# EAGLE schematic AFE (EAGLE 8.3.1)

## Sheet 1 of 2
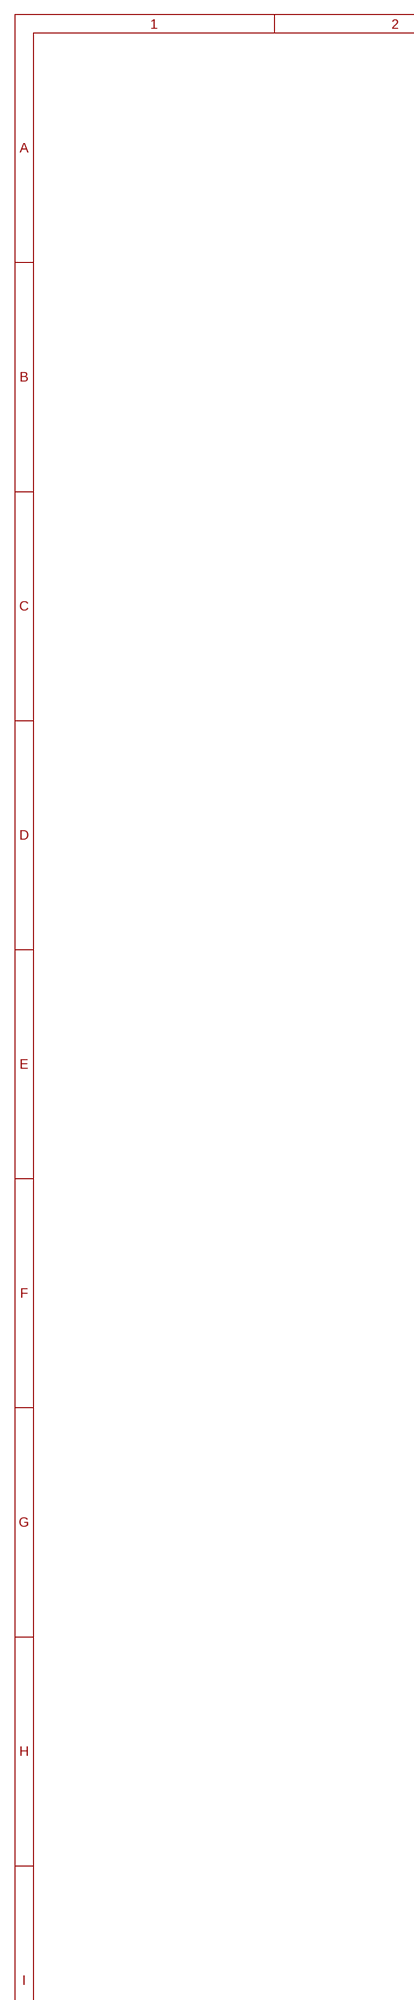
[diagram p0: schematic, sheet 1, part 1 of 2]
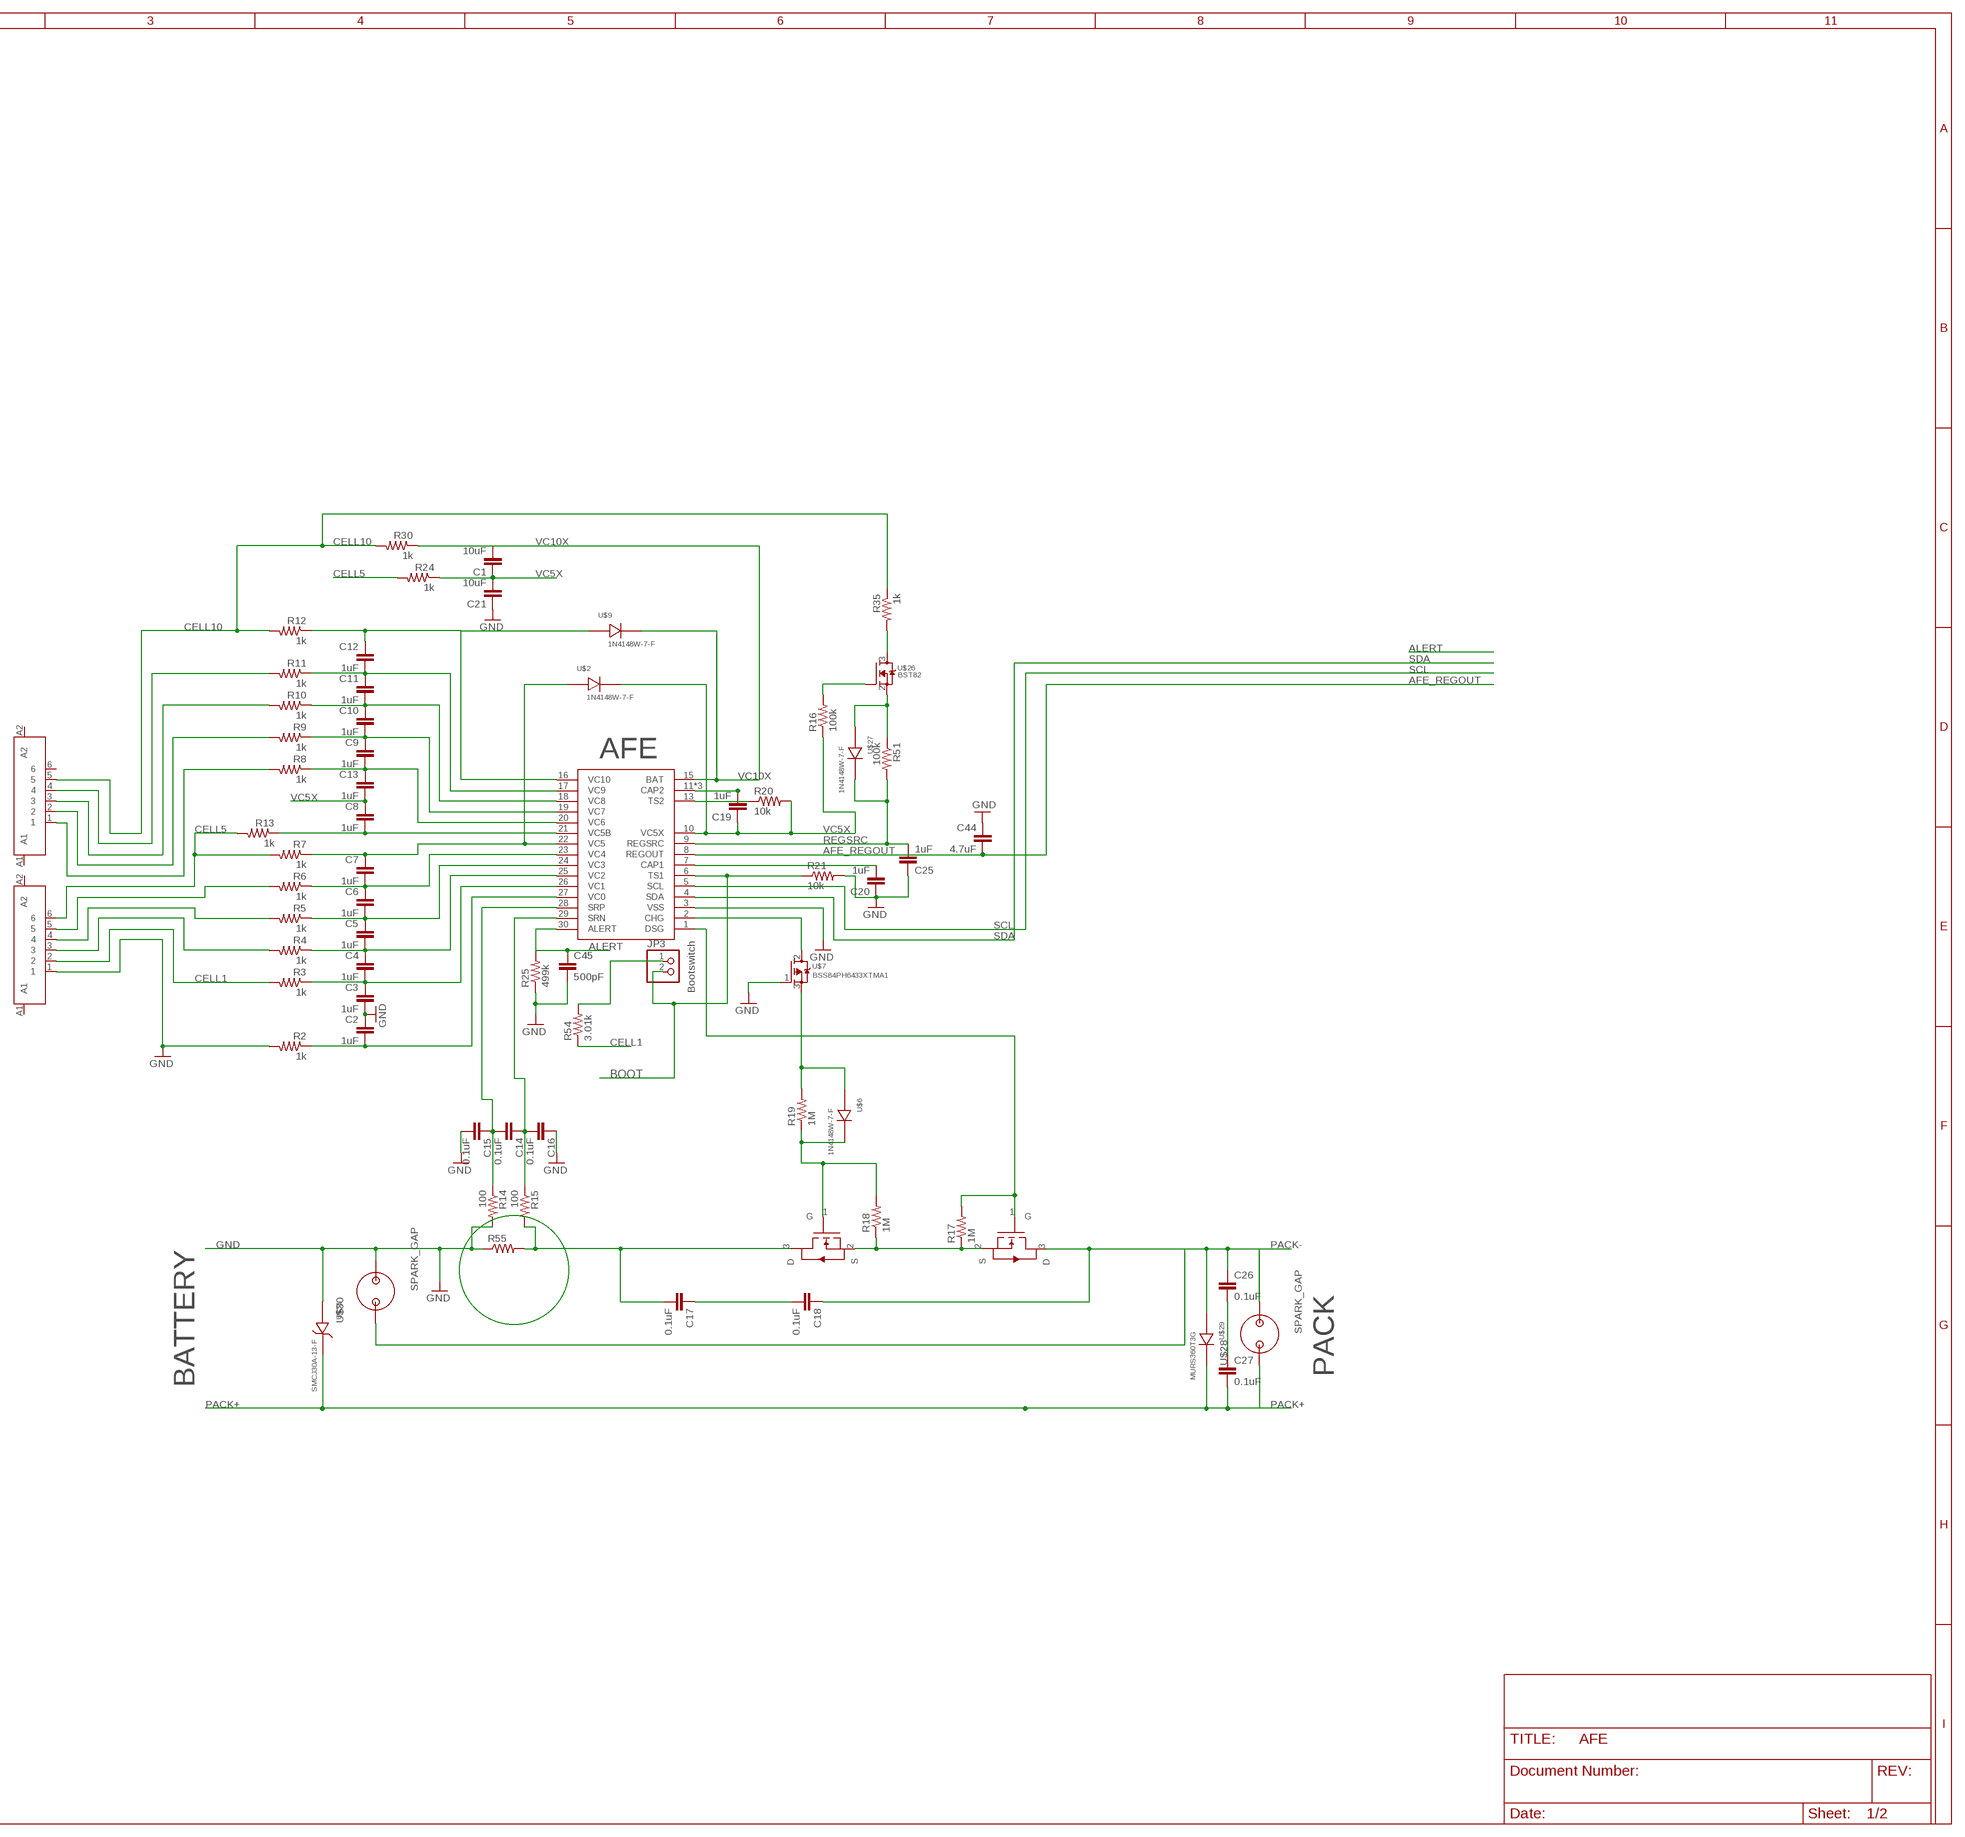
[diagram p1: schematic, sheet 1, part 2 of 2]

### Parts
C1  10uF  C-EUC1210  [C1210]
C2  1uF  C-EUC0805  [C0805]
C3  1uF  C-EUC0805  [C0805]
C4  1uF  C-EUC0805  [C0805]
C5  1uF  C-EUC0805  [C0805]
C6  1uF  C-EUC0805  [C0805]
C7  1uF  C-EUC0805  [C0805]
C8  1uF  C-EUC0805  [C0805]
C9  1uF  C-EUC0805  [C0805]
C10  1uF  C-EUC0805  [C0805]
C11  1uF  C-EUC0805  [C0805]
C12  1uF  C-EUC0805  [C0805]
C13  1uF  C-EUC0805  [C0805]
C14  0.1uF  C-EUC0805  [C0805]
C15  0.1uF  C-EUC0805  [C0805]
C16  0.1uF  C-EUC0805  [C0805]
C17  0.1uF  C-EUC0805  [C0805]
C18  0.1uF  C-EUC0805  [C0805]
C19  1uF  C-EUC0805  [C0805]
C20  1uF  C-EUC0805  [C0805]
C21  10uF  C-EUC1210  [C1210]
C25  1uF  C-EUC0805  [C0805]
C26  0.1uF  C-EUC0805  [C0805]
C27  0.1uF  C-EUC0805  [C0805]
C44  4.7uF  C-EUC0805  [C0805]
C45  500pF  C-EUC0603  [C0603]
JP3  PINHD-1X2  [1X02]
R2  1k  R-US_R1206  [R1206]
R3  1k  R-US_R1206  [R1206]
R4  1k  R-US_R1206  [R1206]
R5  1k  R-US_R1206  [R1206]
R6  1k  R-US_R1206  [R1206]
R7  1k  R-US_R1206  [R1206]
R8  1k  R-US_R1206  [R1206]
R9  1k  R-US_R1206  [R1206]
R10  1k  R-US_R1206  [R1206]
R11  1k  R-US_R1206  [R1206]
R12  1k  R-US_R1206  [R1206]
R13  1k  R-US_R1206  [R1206]
R14  100  R-US_R0805  [R0805]
R15  100  R-US_R0805  [R0805]
R16  100k  R-US_R0805  [R0805]
R17  1M  R-US_R1206  [R1206]
R18  1M  R-US_R1206  [R1206]
R19  1M  R-US_R1206  [R1206]
R20  10k  R-US_R0805  [R0805]
R21  10k  R-US_R0805  [R0805]
R24  1k  R-US_R1206  [R1206]
R25  499k  R-US_R0603  [R0603]
R30  1k  R-US_R1206  [R1206]
R35  1k  R-US_R1206  [R1206]
R51  100k  R-US_R0805  [R0805]
R54  3.01k  R-US_R1206  [R1206]
R55  R-US_R2512  [R2512]
U$1  BQ76930  [SOIC-30]
U$2  1N4148W-7-F  [SOD-123]
U$4  AOB290L  [TO-263]
U$5  AOB290L  [TO-263]
U$6  1N4148W-7-F  [SOD-123]
U$7  BSS84PH6433XTMA1  [SOT23-3]
U$9  1N4148W-7-F  [SOD-123]
U$24  JST_6PIN  [JST_6PIN]
U$26  BST82  [SOT23-3]
U$27  1N4148W-7-F  [SOD-123]
U$28  SPARK_GAP  [SPARK_GAP]
U$29  MURS360T3G  [SMC(DO-214AB)]
U$30  SPARK_GAP  [SPARK_GAP]
U$31  SMCJ30A-13-F  [SMB(DO-214AA)]
U$33  JST_6PIN  [JST_6PIN]

### Nets
AFE_REGOUT: C44.2 U$1.8(REGOUT) ; also sheet 2
ALERT: C45.1 R25.2 U$1.30(ALERT) ; also sheet 2
BOOT: JP3.2 R21.1 U$1.6(TS1)
CELL1: R3.2 R54.1 U$33.2 ; also sheet 2
CELL5: R7.2 R13.2 R24.2 U$33.6
CELL10: R12.2 R30.2 R35.1 U$24.5
CHARGE-: R17.1 R18.1 U$4.2(S) U$5.2(S)
GND: C2.1 C3.2 C15.2 C16.1 C20.1 C21.1 C25.1 C44.1 C45.2 R2.2 R14.2 R21.2 R25.1 R55.1 U$1.3(VSS) U$7.1(G) U$30.P$2 U$31.P$1 U$33.1 ; also sheet 2
N$1: C3.1 C4.2 R3.1 U$1.26(VC1)
N$2: C4.1 C5.2 R4.1 U$1.25(VC2)
N$3: C5.1 C6.2 R5.1 U$1.24(VC3)
N$4: C6.1 C7.2 R6.1 U$1.23(VC4)
N$5: C7.1 R7.1 U$1.22(VC5) U$2.P$1
N$6: C8.2 R13.1 U$1.21(VC5B)
N$7: C9.1 C10.2 R9.1 U$1.19(VC7)
N$8: C10.1 C11.2 R10.1 U$1.18(VC8)
N$9: C11.1 C12.2 R11.1 U$1.17(VC9)
N$10: C12.1 R12.1 U$1.16(VC10) U$9.P$1
N$11: R5.2 U$33.4
N$12: C2.2 R2.1 U$1.27(VC0)
N$14: C26.2 C27.1
N$15: R4.2 U$33.3
N$16: R6.2 U$33.5
N$18: R8.2 U$24.1
N$19: R9.2 U$24.2
N$20: R10.2 U$24.3
N$21: R11.2 U$24.4
N$23: C9.2 C13.1 R8.1 U$1.20(VC6)
N$24: R16.2 U$26.1(G)
N$25: C20.2 U$1.7(CAP1)
N$26: C14.1 C16.2 R15.1 U$1.29(SRN)
N$27: JP3.1 R54.2
N$28: C14.2 C15.1 R14.1 U$1.28(SRP)
N$32: R18.2 R19.1 U$5.1(G) U$6.P$2
N$33: R19.2 U$6.P$1 U$7.3(D)
N$34: U$1.2(CHG) U$7.2(S)
N$35: C17.1 C18.2
N$37: C19.2 U$1.11(CAP2) U$1.12(CAP2) U$1.14(CAP2)
N$38: R20.1 U$1.13(TS2)
N$39: C17.2 R15.2 R55.2 U$5.3(D)
N$42: R17.2 U$1.1(DSG) U$4.1(G)
N$70: R51.1 U$26.2(S) U$27.P$1
N$72: R35.2 U$26.3(D)
PACK+: C27.2 U$28.P$1 U$29.2 U$31.P$2
PACK-: C18.1 C26.1 U$4.3(D) U$28.P$2 U$29.1 U$30.P$1
REGSRC: C25.2 R51.2 U$1.9(REGSRC) U$27.P$2
SCL: U$1.5(SCL) ; also sheet 2
SDA: U$1.4(SDA) ; also sheet 2
VC5X: C1.1 C8.1 C13.2 C19.1 C21.2 R16.1 R20.2 R24.1 U$1.10(VC5X) U$2.P$2
VC10X: C1.2 R30.1 U$1.15(BAT) U$9.P$2
Unconnected: U$24.6 U$24.A1 U$24.A2 U$33.A1 U$33.A2

### Notes on the sheet
- AFE
- Bootswitch
- PACK
- BATTERY

## Sheet 2 of 2
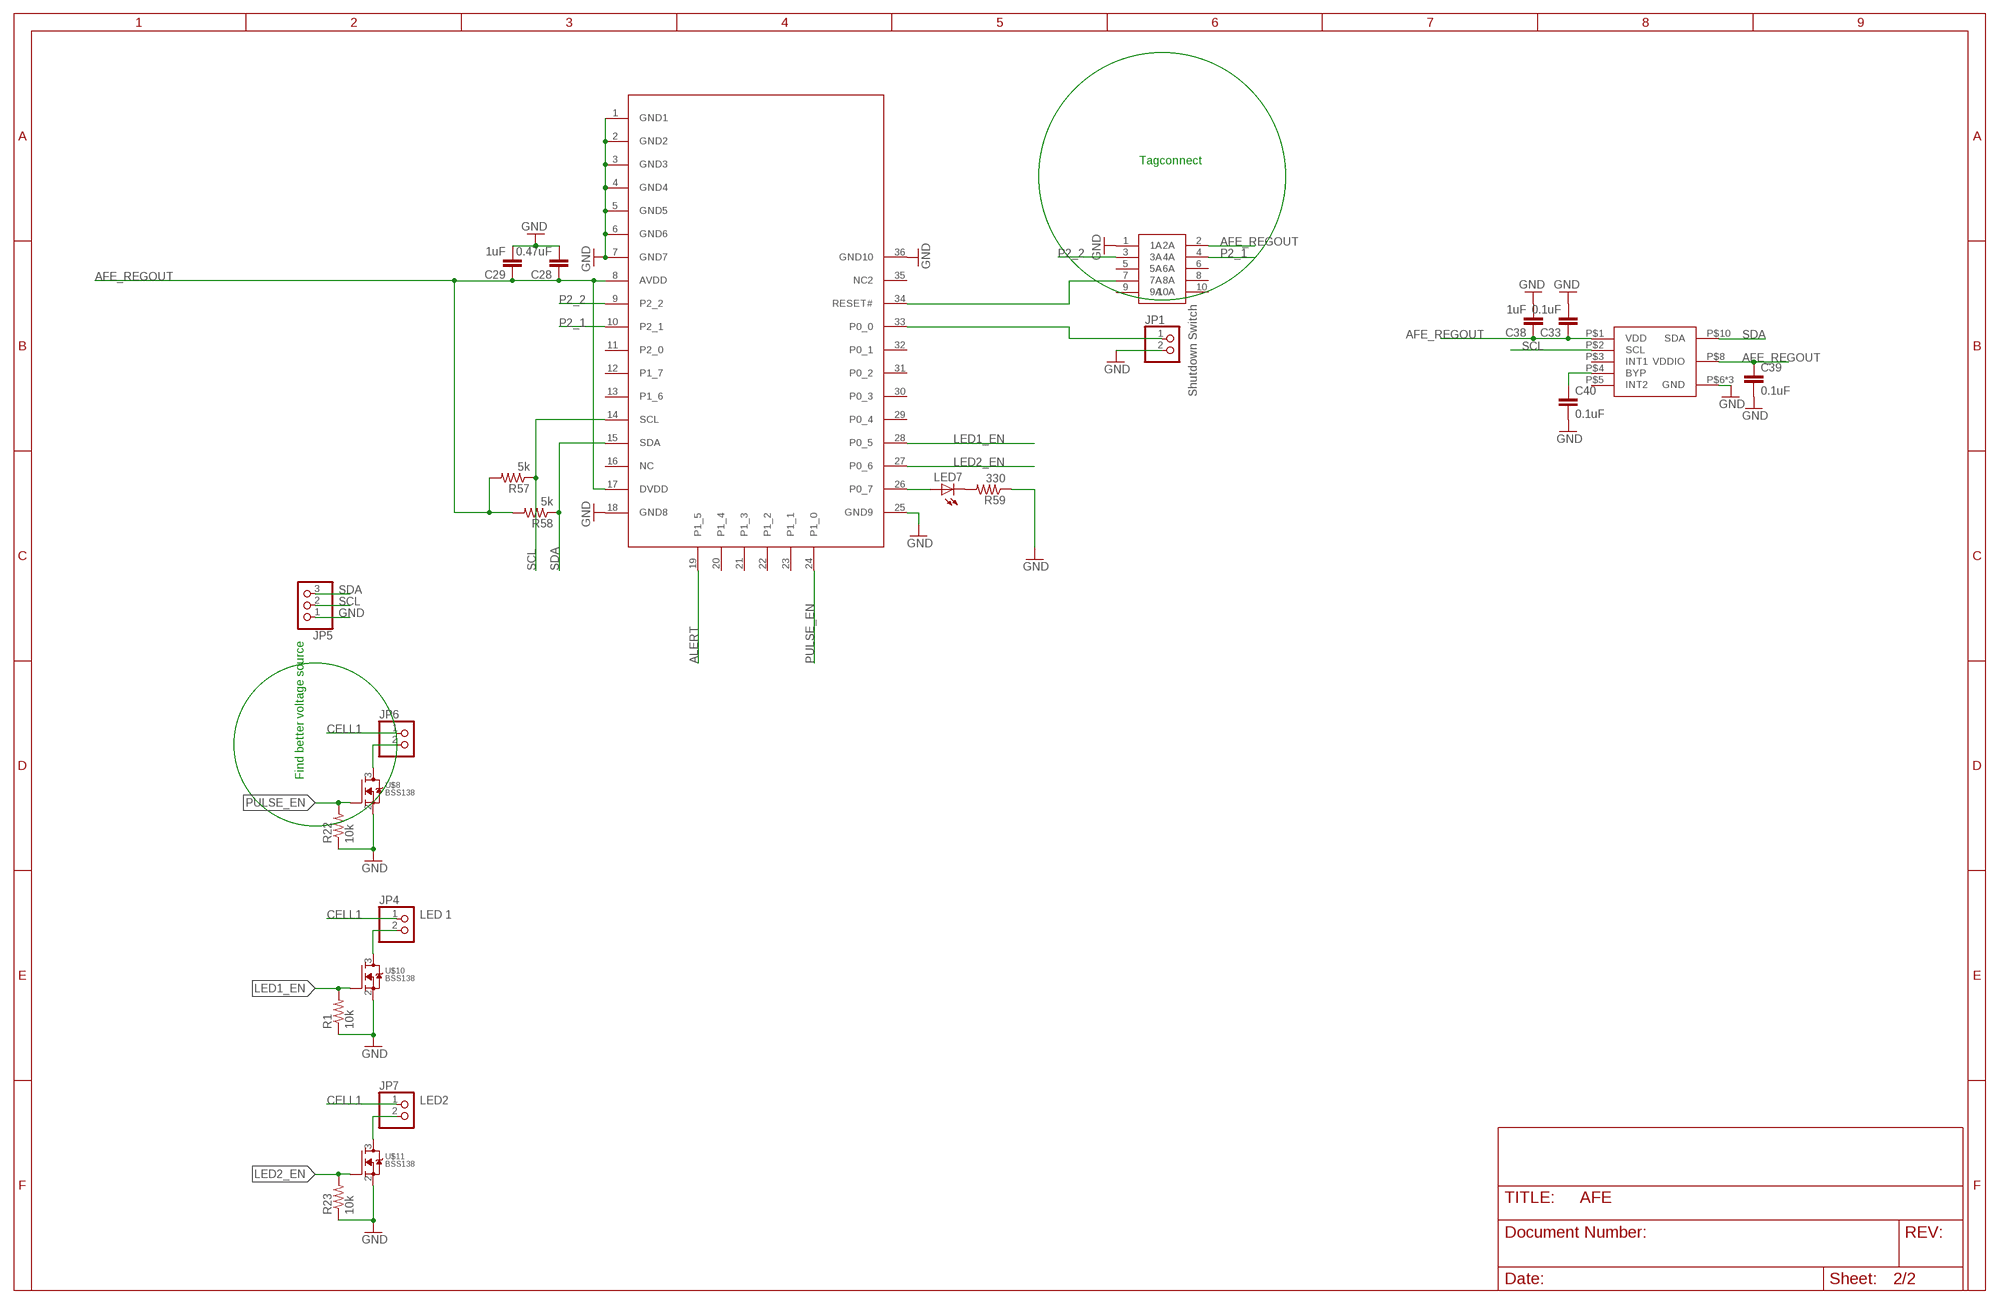
[diagram p2: schematic, sheet 2]

### Parts
C28  0.47uF  C-EUC0402  [C0402]
C29  1uF  C-EUC0402  [C0402]
C33  0.1uF  C-EUC0402  [C0402]
C38  1uF  C-EUC0402  [C0402]
C39  0.1uF  C-EUC0402  [C0402]
C40  0.1uF  C-EUC0402  [C0402]
JP1  PINHD-1X2  [1X02]
JP4  PINHD-1X2  [1X02]
JP5  PINHD-1X3  [1X03]
JP6  PINHD-1X2  [1X02]
JP7  PINHD-1X2  [1X02]
LED7  LEDCHIP-LED0603  [CHIP-LED0603]
R1  10k  R-US_R0402  [R0402]
R22  10k  R-US_R0402  [R0402]
R23  10k  R-US_R0402  [R0402]
R57  5k  R-US_R0402  [R0402]
R58  5k  R-US_R0402  [R0402]
R59  330  R-US_R0402  [R0402]
U$8  BSS138  [SOT23-3]
U$10  BSS138  [SOT23-3]
U$11  BSS138  [SOT23-3]
U$20  BLE113  [BLUEGIGA]
U$22  RIBBON_10POS_MALE  [RIBBON_10POS_MALE]
U$32  MMA8653FC  [10-DFN2X2]

### Nets
AFE_REGOUT: C28.1 C29.1 C33.1 C38.1 C39.1 R57.2 R58.2 U$20.8(AVDD) U$20.17(DVDD) U$22.2(2A) U$32.P$1(VDD) U$32.P$8(VDDIO) ; also sheet 1
ALERT: U$20.19(P1_5) ; also sheet 1
CD: JP1.1 U$20.33(P0_0)
CELL1: JP4.1 JP6.1 JP7.1 ; also sheet 1
GND: C28.2 C29.2 C33.2 C38.2 C39.2 C40.2 JP1.2 JP5.1 R1.1 R22.1 R23.1 R59.1 U$8.2(S) U$10.2(S) U$11.2(S) U$20.1(GND1) U$20.2(GND2) U$20.3(GND3) U$20.4(GND4) U$20.5(GND5) U$20.6(GND6) U$20.7(GND7) U$20.18(GND8) U$20.25(GND9) U$20.36(GND10) U$22.1(1A) U$32.P$6(GND) U$32.P$7(GND) U$32.P$9(GND) ; also sheet 1
LED1_EN: R1.2 U$10.1(G) U$20.28(P0_5)
LED2_EN: R23.2 U$11.1(G) U$20.27(P0_6)
N$29: JP4.2 U$10.3(D)
N$31: JP6.2 U$8.3(D)
N$36: LED7.A U$20.26(P0_7)
N$41: JP7.2 U$11.3(D)
N$76: LED7.C R59.2
N$77: U$20.34(RESET#) U$22.7(7A)
N$84: C40.1 U$32.P$4(BYP)
P2_1: U$20.10(P2_1) U$22.4(4A)
P2_2: U$20.9(P2_2) U$22.3(3A)
PULSE_EN: R22.2 U$8.1(G) U$20.24(P1_0)
SCL: JP5.2 R57.1 U$20.14(SCL) U$32.P$2(SCL) ; also sheet 1
SDA: JP5.3 R58.1 U$20.15(SDA) U$32.P$10(SDA) ; also sheet 1
Unconnected: U$20.11(P2_0) U$20.12(P1_7) U$20.13(P1_6) U$20.16(NC) U$20.20(P1_4) U$20.21(P1_3) U$20.22(P1_2) U$20.23(P1_1) U$20.29(P0_4) U$20.30(P0_3) U$20.31(P0_2) U$20.32(P0_1) U$20.35(NC2) U$22.5(5A) U$22.6(6A) U$22.8(8A) U$22.9(9A) U$22.10(10A) U$32.P$3(INT1) U$32.P$5(INT2)

### Notes on the sheet
- Tagconnect
- Shutdown Switch
- Find better voltage source
- LED 1
- LED2

## Library data of the parts
C1-C21 C25-C29 C33 C38-C40 C44 C45 = rcl:C-EU: CAPACITOR, European symbol
JP1 JP3 JP4 JP6 JP7 = pinhead:PINHD-1X2: PIN HEADER
JP5 = pinhead:PINHD-1X3: PIN HEADER
LED7 = adafruit:LED: LED OSRAM: - CHIPLED LG R971, LG N971, LY N971, LG Q971, LY Q971, LO R971, LY R971 LH N974, LH R974 LS Q976, LO Q976, LY Q976 LO Q996 - Hyper CHIPLED LW Q18S LB Q993, LB Q99A, LB R99A - SideLED LS A670, LO A670, LY A670, LG A670, LP A670 LB A673, LV A673, LT A673, LW A673 LH A674 LY A675 LS A676, LA A676, LO A676, LY A676, LW A676 LS A679, LY A679, LG A679 - Hyper Micro SIDELED® LS Y876, LA Y876, LO Y876, LY Y876 LT Y87S - SmartLED LW L88C, LW L88S LB L89C, LB L89S, LG L890 LS L89K, LO L89K, LY L89K LS L896, LA L896, LO L896, LY L896 - TOPLED LS T670, LO T670, LY T670, LG T670, LP T670 LSG T670, LSP T670, LSY T670, LOP T670, LYG T670 LG T671, LOG T671, LSG T671 LB T673, LV T673, LT T673, LW T673 LH T674 LS T676, LA T676, LO T676, LY T676, LB T676, LH T676, LSB T676, LW T676 LB T67C, LV T67C, LT T67C, LS T67K, LO T67K, LY T67K, LW E67C LS E67B, LA E67B, LO E67B, LY E67B, LB E67C, LV E67C, LT E67C LW T67C LS T679, LY T679, LG T679 LS T770, LO T770, LY T770, LG T770, LP T770 LB T773, LV T773, LT T773, LW T773 LH T774 LS E675, LA E675, LY E675, LS T675 LS T776, LA T776, LO T776, LY T776, LB T776 LHGB T686 LT T68C, LB T68C - Hyper Mini TOPLED® LB M676 - Mini TOPLED Santana® LG M470 LS M47K, LO M47K, LY M47K Source: http://www.osram.convergy.de/
R1-R25 R30 R35 R51 R54 R55 R57-R59 = rcl:R-US_: RESISTOR, American symbol
U$1 = Charles:BQ76930
U$2 U$6 U$9 U$27 = Charles:1N4148W-7-F: DIODE GENERAL PURPOSE 100V 300MA
U$4 U$5 = Charles:AOB290L
U$7 = Charles:BSS84PH6433XTMA1: MOSFET P-Channel 60V 170MA SOT-23
U$8 U$10 U$11 = Charles:BSS138: MOSFET N-CH 50V 220MA
U$20 = James_Updated:BLE113
U$22 = James_Updated:RIBBON_10POS_MALE
U$24 U$33 = James_Updated:JST_6PIN
U$26 = Charles:BST82: MOSFET N-CH 50V 220MA
U$28 U$30 = Charles:SPARK_GAP: Spark Gap 0.2mm ~2kV for ESD Protection
U$29 = Charles:MURS360T3G: Ultrafast Power Rectifier, Diode General Purpose 600V 3A
U$31 = Charles:SMCJ30A-13-F: Zener Diode - 600 Watt Transient Voltage Suppressor - 30VWM 48.4VC - Diode Inc.
U$32 = Charles:MMA8653FC: 3-Axis, 10-bit Digital Accelerometer